# Altium schematic sheet USB_OTG_FS.SchDoc: USB_OTG_FS
size A4; Date: 9/24/2014; Author: P.A.; CompanyName: STMicroelectronics; Organization: Microcontrollers Division; Address1: 12, Rue Jules HOROWITZ; Address2: 38019 Grenoble; Address3: FRANCE; DocumentNumber: 11; Revision: B-07; SheetNumber: 11; SheetTotal: 13; Project: STM32F469I-DISCO
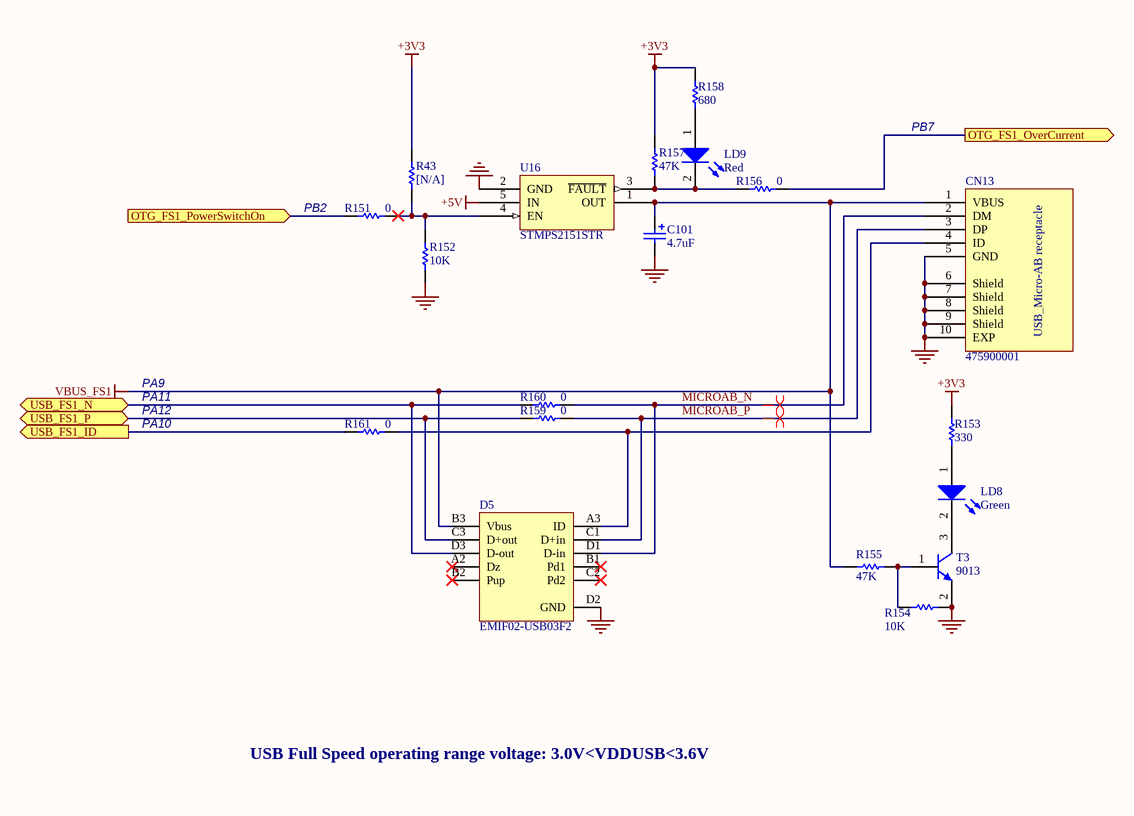
[diagram p0: USB_OTG_FS.SchDoc]

## Parts
C101  4.7uF  [TAN-A]
CN13  475900001  [MOLEX_47590001]
D5  EMIF02-USB03F2  [BGA11_0R5_1R57X2R07]
LD8  Green  [0603D]
LD9  Red  [0603D]
R43  [N/A]  [0603R]
R151  0  [0603R]
R152  10K  [0402R]
R153  330  [0603R]
R154  10K  [0603R]
R155  47K  [0603R]
R156  0  [0603R]
R157  47K  [0603R]
R158  680  [0603R]
R159  0  [0603R]
R160  0  [0603R]
R161  0  [0603R]
T3  9013  [SOT-23]
U16  STMPS2151STR  [SOT23-5]

## Ports
OTG_FS1_OverCurrent (out), OTG_FS1_PowerSwitchOn (in), USB_FS1_ID (out), USB_FS1_N (bidir), USB_FS1_P (bidir)

## Nets
+3V3: R43.1 R153.2 R157.1 R158.2
+5V: U16.5(IN)
GND: C101.2 CN13.5(GND) CN13.6(Shield) CN13.7(Shield) CN13.8(Shield) CN13.9(Shield) CN13.10(EXP) D5.D2(GND) R152.1 R154.1 T3.2(E) U16.2(GND)
VBUS_FS1: C101.1 CN13.1(VBUS) D5.B3(Vbus) R155.1 U16.1(OUT)
MICROAB_N: CN13.2(DM) D5.D1(D-in) R160.1
MICROAB_P: CN13.3(DP) D5.C1(D+in) R159.1
OTG_FS1_OverCurrent: R156.1 ; port OTG_FS1_OverCurrent
OTG_FS1_PowerSwitchOn: R151.2 ; port OTG_FS1_PowerSwitchOn
USB_FS1_ID: R161.2 ; port USB_FS1_ID
USB_FS1_N: D5.D3(D-out) R160.2 ; port USB_FS1_N
USB_FS1_P: D5.C3(D+out) R159.2 ; port USB_FS1_P
NetCN13_4: CN13.4(ID) D5.A3(ID) R161.1
NetLD8_1: LD8.1(A) R153.1
NetLD8_2: LD8.2(K) T3.3(C)
NetLD9_1: LD9.1(A) R158.1
NetLD9_2: LD9.2(K) R156.2 R157.2 U16.3(~{FAULT})
NetR43_2: R43.2 R151.1 R152.2 U16.4(EN)
NetR154_2: R154.2 R155.2 T3.1(B)

Not connected (* = marked no-connect by the designer): D5 A2(Dz)* B1(Pd1)* B2(Pup)* C2(Pd2)*

## Layout directives
differential pair: MICROAB_N, MICROAB_P

## Notes on the sheet
- PB7
- (near R151) PB2
- PA9
- PA10
- PA11
- PA12
- USB Full Speed operating range voltage: 3.0V<VDDUSB<3.6V
- Title:
- Project:
- Size:
- Revision:
- Variant:
- A4
- -
- Date:
- Reference:
- Sheet:
- of
- (in symbol 475900001) USB_Micro-AB receptacle

## Library data of the parts
C101 = Cap Pol1: Polarized Capacitor (Radial); Value: 47uF; Ordered by: Subcon; Published: 8-Jun-2000; Revision: July-2002: Re-released for DXP Platform.; Publisher: Altium Limited
CN13 = 475900001: Manuf_1: MOLEX; Ordered by: Subcon; Silkscreen: USB USER; Manuf_Part_1: 475900001
D5 = EMIF02-USB03F2: 2-line IPAD, EMI filter including ESD protection; Manuf_1: ST; ECCN_US/EU: EAR99/NEC; Ref St: 9179037; Order: EMIF02-USB03F2; Manuf_Part_1: EMIF02-USB03F2; Provided: ST; Distrib: ST; Ordered by: ST
LD8 = LED2: Typical RED, GREEN, YELLOW, AMBER GaAs LED; Ordered by: Subcon; ECCN_US/EU: EAR99/NEC; Silkscreen: VBUS; Published: 8-Jun-2000; Revision: July-2002: Re-released for DXP Platform.; Publisher: Altium Limited
LD9 = LED2: Typical RED, GREEN, YELLOW, AMBER GaAs LED; Ordered by: Subcon; ECCN_US/EU: EAR99/NEC; Silkscreen: FAULT; Published: 8-Jun-2000; Revision: July-2002: Re-released for DXP Platform.; Publisher: Altium Limited
R43 = Res1: Resistor; Value: 1K; Ordered by: Subcon; Fitted: NO; Published: 8-Jun-2000; Revision: July-2002: Re-released for DXP Platform.; Publisher: Altium Limited
R151 R152 R156 R158-R161 = Res1: Resistor; Value: 1K; Ordered by: Subcon; Published: 8-Jun-2000; Revision: July-2002: Re-released for DXP Platform.; Publisher: Altium Limited
R153-R155 R157 = res1: Resistor; Value: 1K; Ordered by: Subcon; Published: 8-Jun-2000; Revision: July-2002: Re-released for DXP Platform.; Publisher: Altium Limited
T3 = NPN: NPN Bipolar Transistor; Manuf_Part_1: MMBT9013; Code - JEDEC: TO-226-AA; Ordered by: Subcon; ECCN_US/EU: EAR99/NEC; Published: 8-Jun-2000; Revision: July-2002: Re-released for DXP Platform.; Publisher: Altium Limited
U16 = STMPS2141STR: Ordered by: ST; Ref St: 9159009; ECCN_US/EU: EAR99/NEC; Manuf_1: ST; Manuf_Part_1: STMPS2151STR